# Altium schematic sheet Audio-HiFi.SchDoc
size A4; SheetNumber: 7; SheetTotal: 9
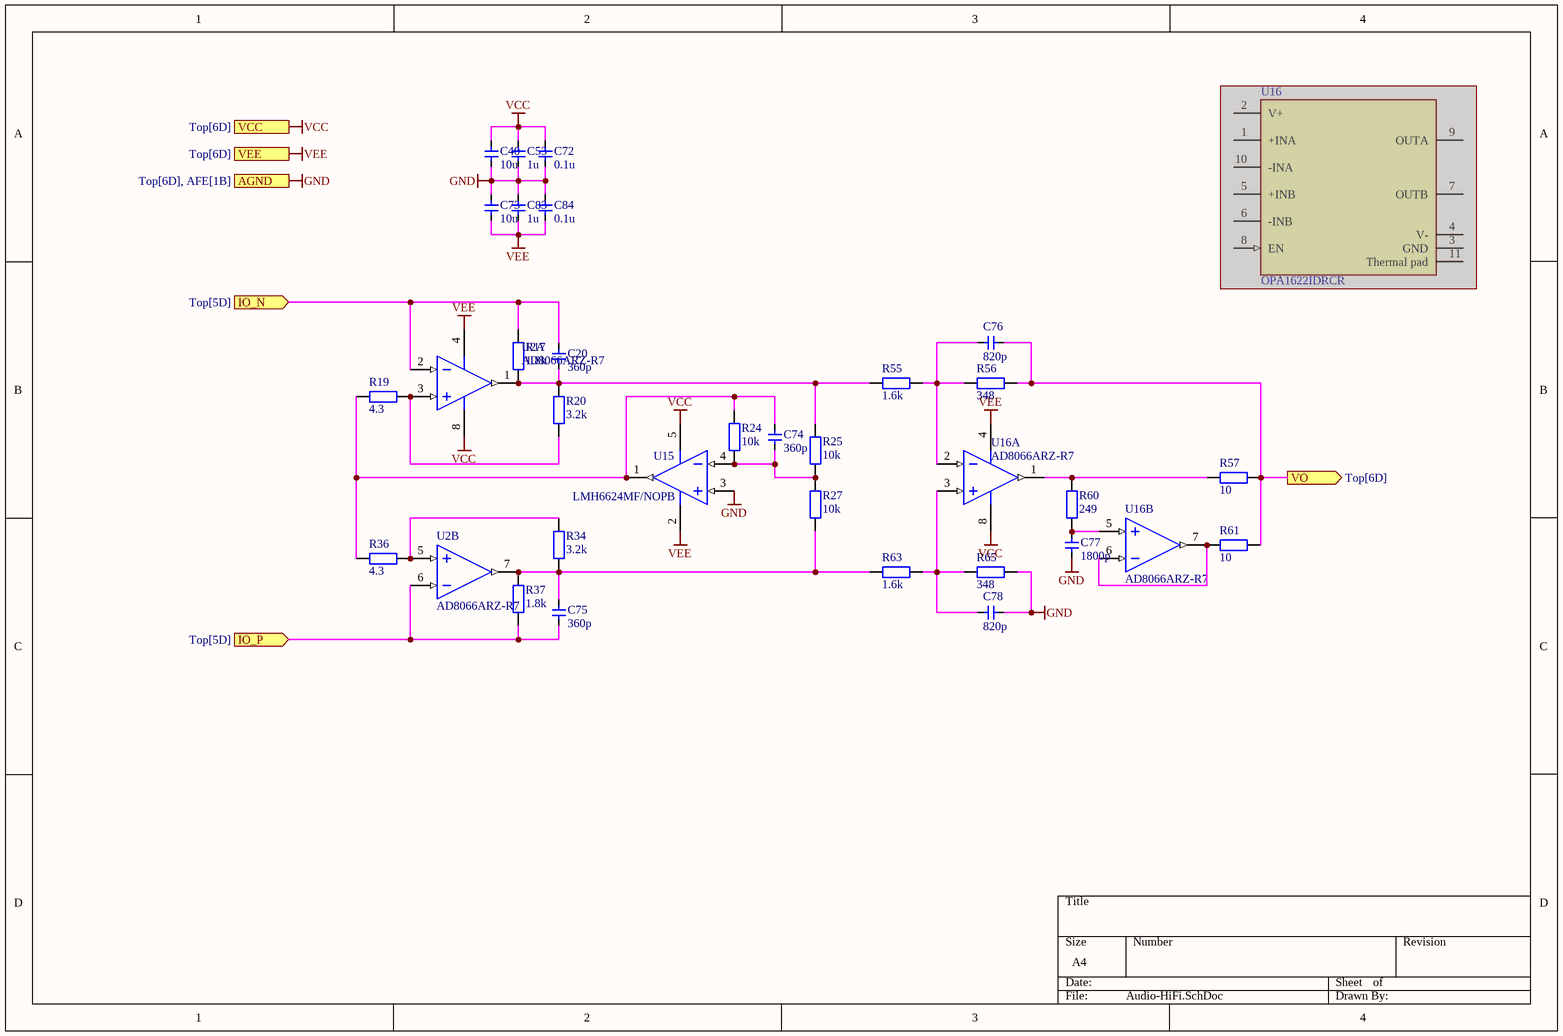
[diagram p0: Audio-HiFi.SchDoc]

## Parts
(Parts that share a designator on the sheet are numbered #1, #2 ... from top to bottom, then left to right.)
C20  360p  [0402-C]
C40  10u  [0402-C]
C53  1u  [0402-C]
C72  0.1u  [0402-C]
C73  10u  [0402-C]
C74  360p  [0402-C]
C75  360p  [0402-C]
C76  820p  [0402-C]
C77  1800p  [0402-C]
C78  820p  [0402-C]
C83  1u  [0402-C]
C84  0.1u  [0402-C]
R17  1.8k  [0402-R]
R19  4.3  [0402-R]
R20  3.2k  [0402-R]
R24  10k  [0402-R]
R25  10k  [0402-R]
R27  10k  [0402-R]
R34  3.2k  [0402-R]
R36  4.3  [0402-R]
R37  1.8k  [0402-R]
R55  1.6k  [0402-R]
R56  348  [0402-R]
R57  10  [0402-R]
R60  249  [0402-R]
R61  10  [0402-R]
R63  1.6k  [0402-R]
R65  348  [0402-R]
U2  AD8066ARZ-R7  [DFN-8_L3.0-W3.0-P0.50-BL-EP]  (parts A,B of 2)
U15  LMH6624MF/NOPB  [DBV0005A_L]
U16#1  OPA1622IDRCR  [FP-DRC0010J-IPC_A]  (masked out: inside a compile mask, not in the netlist)
U16#2  AD8066ARZ-R7  [DFN-8_L3.0-W3.0-P0.50-BL-EP]  (parts A,B of 2)

## Ports
AGND (see Top[6D], AFE[1B]), IO_N (in, see Top[5D]), IO_P (in, see Top[5D]), VCC (see Top[6D]), VEE (see Top[6D]), VO (out, see Top[6D])

## Nets
GND: C40.2 C53.2 C72.2 C73.1 C77.1 C78.1 C83.1 C84.1 R65.2 U15.3(IN+) ; port AGND
VCC: C40.1 C53.1 C72.1 U2.8(+VS) U15.5(V+) U16#2.8(+VS) ; port VCC
VEE: C73.2 C83.2 C84.2 U2.4(-VS) U15.2(V-) U16#2.4(-VS) ; port VEE
IO_N: C20.2 R17.1 U2.2(-IN_1) ; port IO_N
IO_P: C75.1 R37.2 U2.6(-IN_2) ; port IO_P
VO: C76.1 R56.2 R57.2 R61.1 ; port VO
NetC20_1: C20.1 R17.2 R20.1 R25.1 R55.1 U2.1(VOUT_1)
NetC74_1: C74.1 R24.2 R25.2 R27.1 U15.4(IN-)
NetC74_2: C74.2 R19.1 R24.1 R36.1 U15.1(OUT)
NetC75_2: C75.2 R27.2 R34.2 R37.1 R63.1 U2.7(VOUT_2)
NetC76_2: C76.2 R55.2 R56.1 U16#2.2(-IN_1)
NetC77_2: C77.2 R60.2 U16#2.5(+IN_2)
NetC78_2: C78.2 R63.2 R65.1 U16#2.3(+IN_1)
NetR19_2: R19.2 R20.2 U2.3(+IN_1)
NetR34_1: R34.1 R36.2 U2.5(+IN_2)
NetR57_1: R57.1 R60.1 U16#2.1(VOUT_1)
NetR61_2: R61.2 U16#2.6(-IN_2) U16#2.7(VOUT_2)

## Library data of the parts
C20 C40 C53 C73-C78 C83 = 电容-0402: Capacitor; Value: 0.1u
C72 C84 = 电容-0402: Capacitor; Value: 0.1u
R17 R19 R20 R24 R25 R27 R34 R36 R37 R55-R57 R60 R61 R63 R65 = R: 贴片电阻; 联系下单店铺卖家 免费帮你查找封装: 联系下单店铺卖家 免费技术支持; BOM名称: 贴片电阻
U2 U16#2 = AD8066ARZ-R7: Double Channel Low Power Operational Amplifier, 145 MHz BW, 180 V/us SR, Industrial, 8-pin SOIC (R-8), Reel; Manufacturer: Analog Devices; Generic Part Number: AD8066; Small Signal Bandwidth: 145MHz; V Span Min: 5V; Input Offset Voltage: 400uV; V Span Max: 24V; Input Bias Current: 2pA; Amplifiers Per Package: 2; Iq/Amp: 7.4mA; ComponentLink1URL: http://www.analog.com/en/index.html; ComponentLink4Description: Reference Circuit; ComponentLink3URL: http://www.analog.com/static/imported-files/packages/PKG_PDF/SOIC_Narrow%20(R)/R_8.pdf; Code_JEDEC: MS-012-AA; ComponentLink3Description: Package Specification; ComponentLink4URL: http://www.analog.com/en/all-operational-amplifiers-op-amps/operational-amplifiers-op-amps/ad8066/products/product.html#product-recommendations; RevisionNote: Reference Circuit URL fixed; ComponentLink1Description: Manufacturer URL; PackageDescription: 8-Pin Standard Small Outline Package, Body 3.9 x 4.9 mm, Pitch 1.27 mm; PackageReference: R-8; Slew Rate: 180V/us; PackageVersion: 060506-A; Mounting Technology: Surface Mount; ComponentLink2Description: Datasheet; ComponentLink2URL: http://www.analog.com/static/imported-files/data_sheets/AD8065_8066.pdf; PartNumber: AD8066ARZ-R7; DatasheetVersion: Rev. J
U15 = CMP-0055-01252-3: Single/ Dual Ultra Low Noise Wideband Operational Amplifier, 5-pin SOT-23, Pb-Free; Manufacturer: Texas Instruments; CompType: Amplifiers; PowerWise: Y; PackageTopMarking: A94A*XTT; PinCount: 5; ComponentLink1URL: http://www.ti.com/general/docs/lit/getliterature.tsp?genericPartNumber=LMH6624&fileType=pdf; RoHS: Y; Package Reference: DBV0005A; ComponentLink1Description: Datasheet URL; PackageDescription: Molded SOT-23, .115 x .063 x .040 in Body, 5 Lead, .0375 in Pitch
U16#1 = CMP-04895-000274-1: IC AUDIO 2 CIRCUIT 10VSON; Gain Bandwidth Product: 32MHz; Number of Channels: 2; Max Output Power: 100mW; Min Operating Temperature: -40°C; Max Operating Temperature: 125°C; RoHS Compliant: Yes; Mount: Surface Mount; Packaging: Tape and Reel; Lead Free: Lead Free